# EAGLE design ManualMotorDriver (EAGLE 9.6.2)
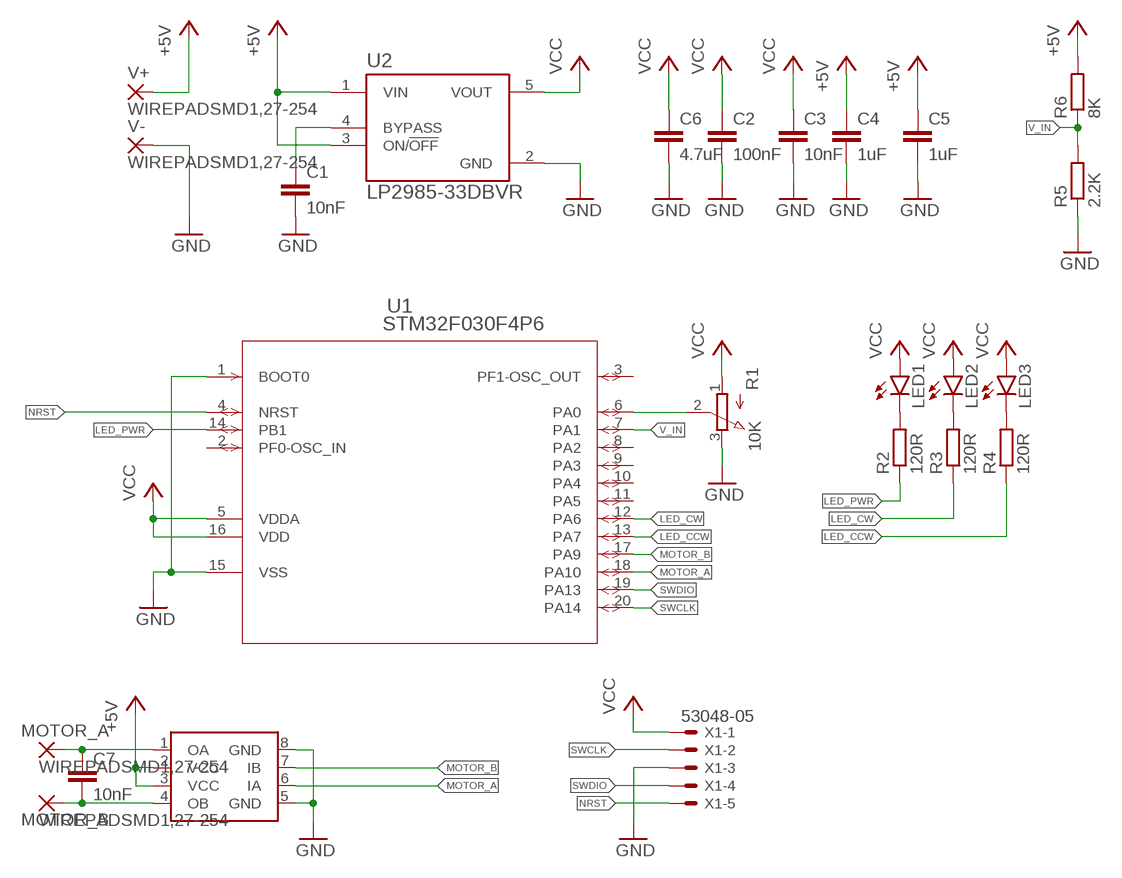
[diagram p0: schematic, sheet 1]

## Parts
C1  10nF  C-EUC0402K  [C0402K]
C2  100nF  C-EUC0402K  [C0402K]
C3  10nF  C-EUC0402K  [C0402K]
C4  1uF  C-EUC0402K  [C0402K]
C5  1uF  C-EUC0402K  [C0402K]
C6  4.7uF  C-EUC0805  [C0805]
C7  10nF  C-EUC0805  [C0805]
LED1  LEDCHIP-LED0603  [CHIP-LED0603]
LED2  LEDCHIP-LED0603  [CHIP-LED0603]
LED3  LEDCHIP-LED0603  [CHIP-LED0603]
MOTOR_A  WIREPADSMD1,27-254  [SMD1,27-2,54]
MOTOR_B  WIREPADSMD1,27-254  [SMD1,27-2,54]
R1  10K  EVUF3L  [EVUFXL]
R2  120R  R-EU_R0402  [R0402]
R3  120R  R-EU_R0402  [R0402]
R4  120R  R-EU_R0402  [R0402]
R5  2.2K  R-EU_R0402  [R0402]
R6  8K  R-EU_R0402  [R0402]
U1  STM32F030F4P6  [TSSOP20]
U2  LP2985-33DBVR  [SOT95P280X145-5N]
U3  L9110SO8  [SO-08]
V+  WIREPADSMD1,27-254  [SMD1,27-2,54]
V-  WIREPADSMD1,27-254  [SMD1,27-2,54]
X1  53048-05  [53048-05]

## Nets
+5V: C4.1 C5.1 R6.2 U2.1(VIN) U2.3(ON/!OFF) U3.2(VCC) U3.3(VCC) V+.1(P)
GND: C1.2 C2.2 C3.2 C4.2 C5.2 C6.2 R1.3(E) R5.1 U1.1(BOOT0) U1.15(VSS) U2.2(GND) U3.5(GND) U3.8(GND) V-.1(P) X1.3
LED_CCW: R4.1 U1.13(PA7)
LED_CW: R3.1 U1.12(PA6)
LED_PWR: R2.1 U1.14(PB1)
MOTOR_A: U1.18(PA10) U3.6(IA)
MOTOR_B: U1.17(PA9) U3.7(IB)
N$1: R1.2(S) U1.6(PA0)
N$2: LED1.C R2.2
N$3: C1.1 U2.4(BYPASS)
N$4: C7.1 MOTOR_A.1(P) U3.1(OA)
N$5: C7.2 MOTOR_B.1(P) U3.4(OB)
N$6: LED2.C R3.2
N$7: LED3.C R4.2
NRST: U1.4(NRST) X1.5
SWCLK: U1.20(PA14) X1.2
SWDIO: U1.19(PA13) X1.4
V_IN: R5.2 R6.1 U1.7(PA1)
VCC: C2.1 C3.1 C6.1 LED1.A LED2.A LED3.A R1.1(A) U1.5(VDDA) U1.16(VDD) U2.5(VOUT) X1.1
Unconnected: U1.2(PF0-OSC_IN) U1.3(PF1-OSC_OUT) U1.8(PA2) U1.9(PA3) U1.10(PA4) U1.11(PA5)

## Library data of the parts
C1-C7 = rcl:C-EU: CAPACITOR, European symbol; SPICEPREFIX: C
LED1-LED3 = led:LED: LED OSRAM: - CHIPLED LG R971, LG N971, LY N971, LG Q971, LY Q971, LO R971, LY R971 LH N974, LH R974 LS Q976, LO Q976, LY Q976 LO Q996 - Hyper CHIPLED LW Q18S LB Q993, LB Q99A, LB R99A - SideLED LS A670, LO A670, LY A670, LG A670, LP A670 LB A673, LV A673, LT A673, LW A673 LH A674 LY A675 LS A676, LA A676, LO A676, LY A676, LW A676 LS A679, LY A679, LG A679 - Hyper Micro SIDELED® LS Y876, LA Y876, LO Y876, LY Y876 LT Y87S - SmartLED LW L88C, LW L88S LB L89C, LB L89S, LG L890 LS L89K, LO L89K, LY L89K LS L896, LA L896, LO L896, LY L896 - TOPLED LS T670, LO T670, LY T670, LG T670, LP T670 LSG T670, LSP T670, LSY T670, LOP T670, LYG T670 LG T671, LOG T671, LSG T671 LB T673, LV T673, LT T673, LW T673 LH T674 LS T676, LA T676, LO T676, LY T676, LB T676, LH T676, LSB T676, LW T676 LB T67C, LV T67C, LT T67C, LS T67K, LO T67K, LY T67K, LW E67C LS E67B, LA E67B, LO E67B, LY E67B, LB E67C, LV E67C, LT E67C LW T67C LS T679, LY T679, LG T679 LS T770, LO T770, LY T770, LG T770, LP T770 LB T773, LV T773, LT T773, LW T773 LH T774 LS E675, LA E675, LY E675, LS T675 LS T776, LA T776, LO T776, LY T776, LB T776 LHGB T686 LT T68C, LB T68C - Hyper Mini TOPLED® LB M676 - Mini TOPLED Santana® LG M470 LS M47K, LO M47K, LY M47K Source: http://www.osram.convergy.de LUXEON: - LUMILED® LXK2-PW12-R00, LXK2-PW12-S00, LXK2-PW14-U00, LXK2-PW14-V00 LXK2-PM12-R00, LXK2-PM12-S00, LXK2-PM14-U00 LXK2-PE12-Q00, LXK2-PE12-R00, LXK2-PE12-S00, LXK2-PE14-T00, LXK2-PE14-U00 LXK2-PB12-K00, LXK2-PB12-L00, LXK2-PB12-M00, LXK2-PB14-N00, LXK2-PB14-P00, LXK2-PB14-Q00 LXK2-PR12-L00, LXK2-PR12-M00, LXK2-PR14-Q00, LXK2-PR14-R00 LXK2-PD12-Q00, LXK2-PD12-R00, LXK2-PD12-S00 LXK2-PH12-R00, LXK2-PH12-S00 LXK2-PL12-P00, LXK2-PL12-Q00, LXK2-PL12-R00 Source: www.luxeon.com KINGBRIGHT: KA-3528ASYC Source: www.kingbright.com
MOTOR_A MOTOR_B V+ V- = wirepad:WIREPAD: Wire PAD connect wire on PCB
R1 = pot:EVU: 9 mm Square Rotary Potentiometers Source: Panasonic
R2-R6 = rcl:R-EU_: RESISTOR, European symbol; SPICEPREFIX: R
U1 = STEMFIE_Electrics:STM32F030F4P6; COPYRIGHT: Copyright (C) 2022 Ultra Librarian. All rights reserved.; MANUFACTURER_PART_NUMBER: STM32F030F4P6; MFR_NAME: STMicroelectronics
U2 = STEMFIE_Electrics:LP2985-33DBVR: 150-mA, 16-V, low-dropout voltage regulator with enable 5-SOT-23 -40 to 125 Check availability <https://pricing.snapeda.com/parts/LP2985-33DBVR/Texas%20Instruments/view-part?ref=eda>; AVAILABILITY: In Stock; DESCRIPTION: 150-mA, 16-V, low-dropout voltage regulator with enable 5-SOT-23 -40 to 125; MF: Texas Instruments; MP: LP2985-33DBVR; PACKAGE: SOT-23-5 Texas Instruments; PRICE: None; PURCHASE-URL: https://pricing.snapeda.com/search/part/LP2985-33DBVR/?ref=eda
U3 = STEMFIE_Electrics:L9110: Check availability <https://pricing.snapeda.com/parts/L9110%20%28SOP-8%29/Asic/view-part?ref=eda>; AVAILABILITY: Not in stock; DESCRIPTION: Motor control driver chip; MF: Asic; MP: L9110 (SOP-8); PACKAGE: Package; PRICE: None
X1 = con-molex:53?-05: CONNECTOR wire to board 1.25 mm (.049 inch) pitch header; MF: MOLEX; MPN: 53048-0510; OC_FARNELL: 9732926; OC_NEWARK: 57H4722

## Board
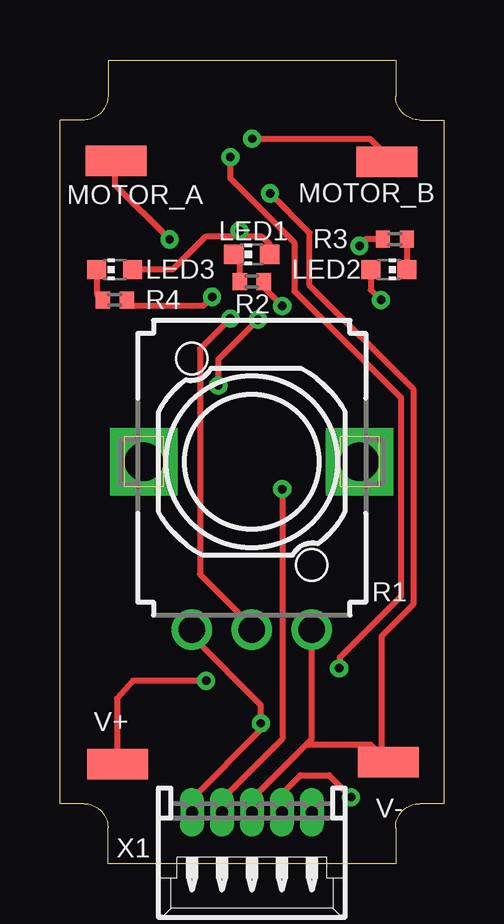
[diagram p1: board, top side]
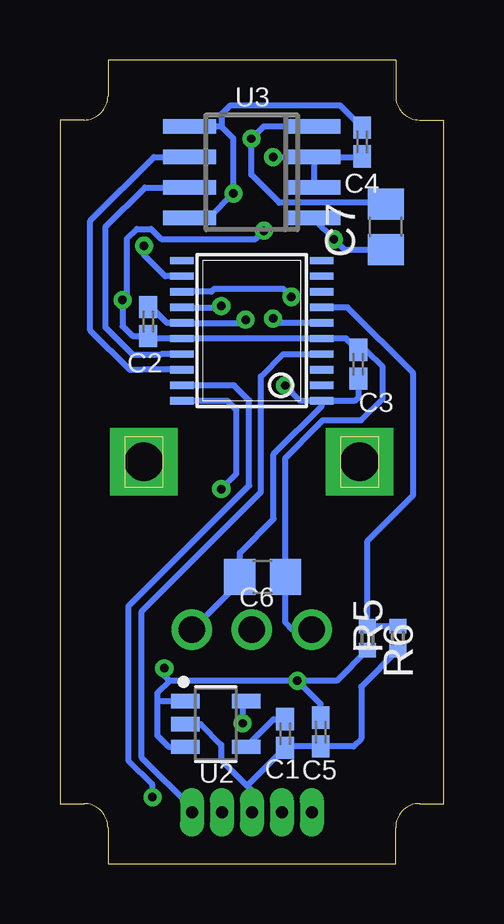
[diagram p2: board, bottom side, seen from below]

Size 16 x 33.5 mm. Coordinates in mm from the lower left corner, seen from the top.
Outline: 14,0 2,0 2,1.5 arc90 1,2.5 0,2.5 0,31 1,31 arc90 2,32 2,33.5 14,33.5 14,32 arc90 15,31 16,31 16,2.5 15,2.5 arc90 14,1.5 14,0
Copper layers (1*16): Top 0.035mm / dielectric 1.5mm / Bottom 0.035mm
Design rules "default *": minimum track width 6mil, minimum drill 0.35mm, track to track 8mil, track to pad 8mil, pad to pad 8mil, via to via 8mil, smd to smd 8mil, copper to edge 40mil, drill to drill 6mil, minimum pad ring 10mil, minimum via ring 8mil, stop-mask expansion 4mil, vias tented up to drill 0mil, thermal gap 10mil

### Footprints (pad centres in the part's own frame; a part is rotated, then mirrored left to right if it is on the bottom)
C0402K = smd 0.925 x 0.74: 1 -0.6,0; 2 0.6,0
C0805 = smd 1.3 x 1.5: 1 -0.95,0; 2 0.95,0
CHIP-LED0603 = smd 0.8 x 0.8: A 0,-0.75; C 0,0.75
SMD1,27-2,54 = smd 1.27 x 2.54: 1 0,0
EVUFXL = drill 1.1 pad 1.676: 1 -2.5,-7; 2 0,-7; 3 2.5,-7 | drill 1.6 pad 2.8 square: M1 4.5,0; M2 -4.5,0
R0402 = smd 0.6 x 0.7: 1 -0.5,0; 2 0.5,0
TSSOP20 = smd 0.305 x 0.991: 1 -2.925,-2.918; 2 -2.275,-2.918; 3 -1.625,-2.918; 4 -0.975,-2.918; 5 -0.325,-2.918; 6 0.325,-2.918; 7 0.975,-2.918; 8 1.625,-2.918; 9 2.275,-2.918; 10 2.925,-2.918; 11 2.925,2.918; 12 2.275,2.918; 13 1.625,2.918; 14 0.975,2.918; 15 0.325,2.918; 16 -0.325,2.918; 17 -0.975,2.918; 18 -1.625,2.918; 19 -2.275,2.918; 20 -2.925,2.918
SOT95P280X145-5N = smd 1.186 x 0.597: 1 -1.264,0.95; 2 -1.264,0; 3 -1.264,-0.95; 4 1.264,-0.95; 5 1.264,0.95
SO-08 = smd 0.6 x 2.2: 1 -1.905,-2.6; 2 -0.635,-2.6; 3 0.635,-2.6; 4 1.905,-2.6; 5 1.905,2.6; 6 0.635,2.6; 7 -0.635,2.6; 8 -1.905,2.6
53048-05 = drill 0.5 pad 0.698 long: 1 2.5,-1.25; 2 1.25,-1.25; 3 0,-1.25; 4 -1.25,-1.25; 5 -2.5,-1.25

### Placement (x,y rotation side)
C1  6.61,5.42 270 bottom
C2  12.32,22.59 90 bottom
C3  3.56,20.82 270 bottom
C4  3.39,30.08 90 bottom
C5  5.13,5.48 270 bottom
C6  7.55,11.95 180 bottom
C7  2.41,26.54 90 bottom
LED1  8,25.4 90 top
LED2  13.72,24.77 270 top
LED3  2.29,24.77 90 top
MOTOR_A  2.34,29.3 90 top
MOTOR_B  13.64,29.25 90 top
R1  8,16.75 0 top
R2  8,24.26 180 top
R3  13.97,26.04 0 top
R4  2.29,23.5 180 top
R5  1.91,9.4 90 bottom
R6  3.17,9.4 270 bottom
U1  8,22.21 90 bottom
U2  9.5,5.82 0 bottom
U3  8,28.82 90 bottom
V+  2.4,4.15 90 top
V-  13.7,4.23 90 top
X1  8,0.89 180 top

### Tracks (layer width: path | path; a pad name or v marks a point on that pad's centre or on a via)
+5V  (via drill 0.35)
  Top 0.254: v6.1,7.62 3.05,7.62 2.38,6.87 2.38,4.17 V+.1 | v11.65,8.14 11.67,8.16 11.67,8.59 14.23,11.15 14.23,19.41 9.78,23.86 9.78,25.89 7.11,28.56 v7.11,29.45
  Bottom 0.254: U3.3 U3.2 | C4.1 3.42,29.45 U3.3 | 11.94,6.86 11.94,7.11 11.43,7.62 | 11.94,6.86 11.94,5.33 11.47,4.87 U2.3 | v6.1,7.62 11.43,7.62 | U2.1 11.85,6.76 11.94,6.86 | C5.1 5.13,6.65 v6.1,7.62 | 11.43,7.62 11.65,7.84 v11.65,8.14 | v7.11,29.45 U3.3 | R6.2 4.45,7.62 v6.1,7.62
GND  (via drill 0.35)
  Top 0.254: v8.26,22.67 6.6,21.02 v6.6,19.93 | X1.3 8,2.69 10.28,4.96 | 10.28,4.96 10.5,5.19 R1.3 | v8.76,27.94 10.41,26.29 10.41,24.1 14.73,19.79 14.73,10.79 13.41,9.47 13.41,4.52 | 10.28,4.96 12.96,4.96 13.41,4.52 | 13.41,4.52 V-.1
  Bottom 0.254: 3.66,20.32 C3.2 3.56,19.43 3.7,19.29 U1.1 | C2.2 12.19,23.19 11.53,22.54 U1.15 8.39,22.54 v8.26,22.67 | 10.35,26.79 U3.8 9.79,26.91 v8.76,27.94 8.76,30.22 9.27,30.72 | C4.2 4.32,31.61 8.89,31.61 9.27,31.23 9.27,30.72 | U2.2 10.13,5.82 9.27,4.95 9.27,4.32 8.19,3.24 | X1.3 8,3.05 8.19,3.24 | 8.19,3.24 C1.2 6.55,4.88 C5.2 3.75,4.88 3.43,5.21 3.43,7.37 R5.1 | R1.3 8.5,11.75 C6.2 8.5,12.95 7.08,14.37 7.08,17.08 5.08,19.08 U1.1 | U1.1 4.57,19.29 | v6.6,19.93 5.96,19.29 U1.1 | 9.27,30.72 U3.5
LED_CCW  (via drill 0.35)
  Top 0.254: R4.1 3.04,23.24 5.97,23.24 v6.35,23.62
  Bottom 0.254: U1.13 9.68,23.84 9.56,23.95 6.68,23.95 v6.35,23.62
LED_CW  (via drill 0.35)
  Top 0.254: R3.1 12.78,26.04 v12.49,25.75
  Bottom 0.254: U1.12 11.61,24.49 12.49,25.37 v12.49,25.75
LED_PWR  (via drill 0.35)
  Top 0.254: v9.27,23.24 8.5,24.01 R2.1
  Bottom 0.254: U1.14 9.33,23.19 v9.27,23.24
MOTOR_A
  Bottom 0.254: U1.18 12.56,20.59 12.57,20.57 13.08,20.57 14.73,22.23 14.73,26.8 12.08,29.45 U3.6
MOTOR_B
  Bottom 0.254: U1.17 11.78,21.24 11.81,21.2 12.95,21.2 14.1,22.35 14.1,26.54 12.46,28.18 U3.7
N$1  (via drill 0.35)
  Top 0.254: R1.2 8,9.89 5.84,12.05 5.84,21.45 v7.11,22.72
  Bottom 0.254: v7.11,22.72 7.04,22.72 6.86,22.54 U1.6
N$2
  Top 0.254: R2.2 7.5,25.15 LED1.C
N$3
  Bottom 0.254: U2.4 7.09,6.02 C1.1
N$4  (via drill 0.35)
  Top 0.254: v4.57,26.02 2.29,28.3 2.29,29.25 MOTOR_A.1
  Bottom 0.254: U3.1 5.4,26.85 v4.57,26.02 4.14,25.59 C7.1
N$5  (via drill 0.35)
  Top 0.254: MOTOR_B.1 13.64,29.5 12.93,30.22 v8.01,30.22
  Bottom 0.254: U3.4 7.51,30.72 v8.01,30.22 8.01,28.71 6.85,27.55 2.47,27.55 C7.2
N$6
  Top 0.254: R3.2 LED2.C
N$7
  Top 0.254: LED3.C 1.54,23.75 R4.2
NRST
  Bottom 0.254: U1.4 6.69,21.24 7.62,20.31 7.62,15.48 9.01,14.09 12.58,10.52 12.58,4.41 10.5,2.33 X1.5
SWCLK  (via drill 0.35)
  Top 0.254: X1.2 6.75,2.69 9.27,5.21 v9.27,15.61
  Bottom 0.254: U1.20 9.01,19.29 8.64,18.91 8.64,16.24 v9.27,15.61
SWDIO  (via drill 0.35)
  Top 0.254: v12.14,2.77 11.22,3.68 10.03,3.68 9.25,2.9 X1.4
  Bottom 0.254: v12.14,2.77 12.14,3.27 13.15,4.29 13.15,10.71 8.11,15.76 8.11,19.31 8.73,19.94 U1.19
V_IN
  Bottom 0.254: R5.2 R6.1 3.17,13.45 1.27,15.36 1.27,20.45 4.01,23.19 U1.7
VCC  (via drill 0.35)
  Top 0.254: R1.1 5.5,9.49 8.38,6.6 v8.38,5.84 8.38,5.59 5.5,2.71 X1.1 | LED2.A 12.97,23.92 v13.39,23.5 | LED1.A 8.75,25.8 8.42,26.13 7.62,26.13 | 7.62,26.13 6.06,26.13 4.7,24.77 LED3.A | v7.49,26.38 7.62,26.25 7.62,26.13
  Bottom 0.254: U1.5 4.7,21.89 | U2.5 8.38,6.62 v8.38,5.84 | R1.1 6.29,9.75 6.6,10.06 C6.1 6.6,16.9 5.23,18.27 5.23,18.29 5.04,18.48 3.43,18.48 2.54,19.37 2.54,20.7 3.25,21.42 C3.1 3.6,21.42 4.07,21.89 U1.5 | U1.5 U1.16 11.43,21.89 12.21,21.89 C2.1 12.98,21.99 13.39,22.41 v13.39,23.5 13.2,23.68 13.2,26.04 12.79,26.46 12.2,26.46 11.78,26.04 7.84,26.04 v7.49,26.38